# EAGLE design Serial-7-Segment-Display (EAGLE 6.4)
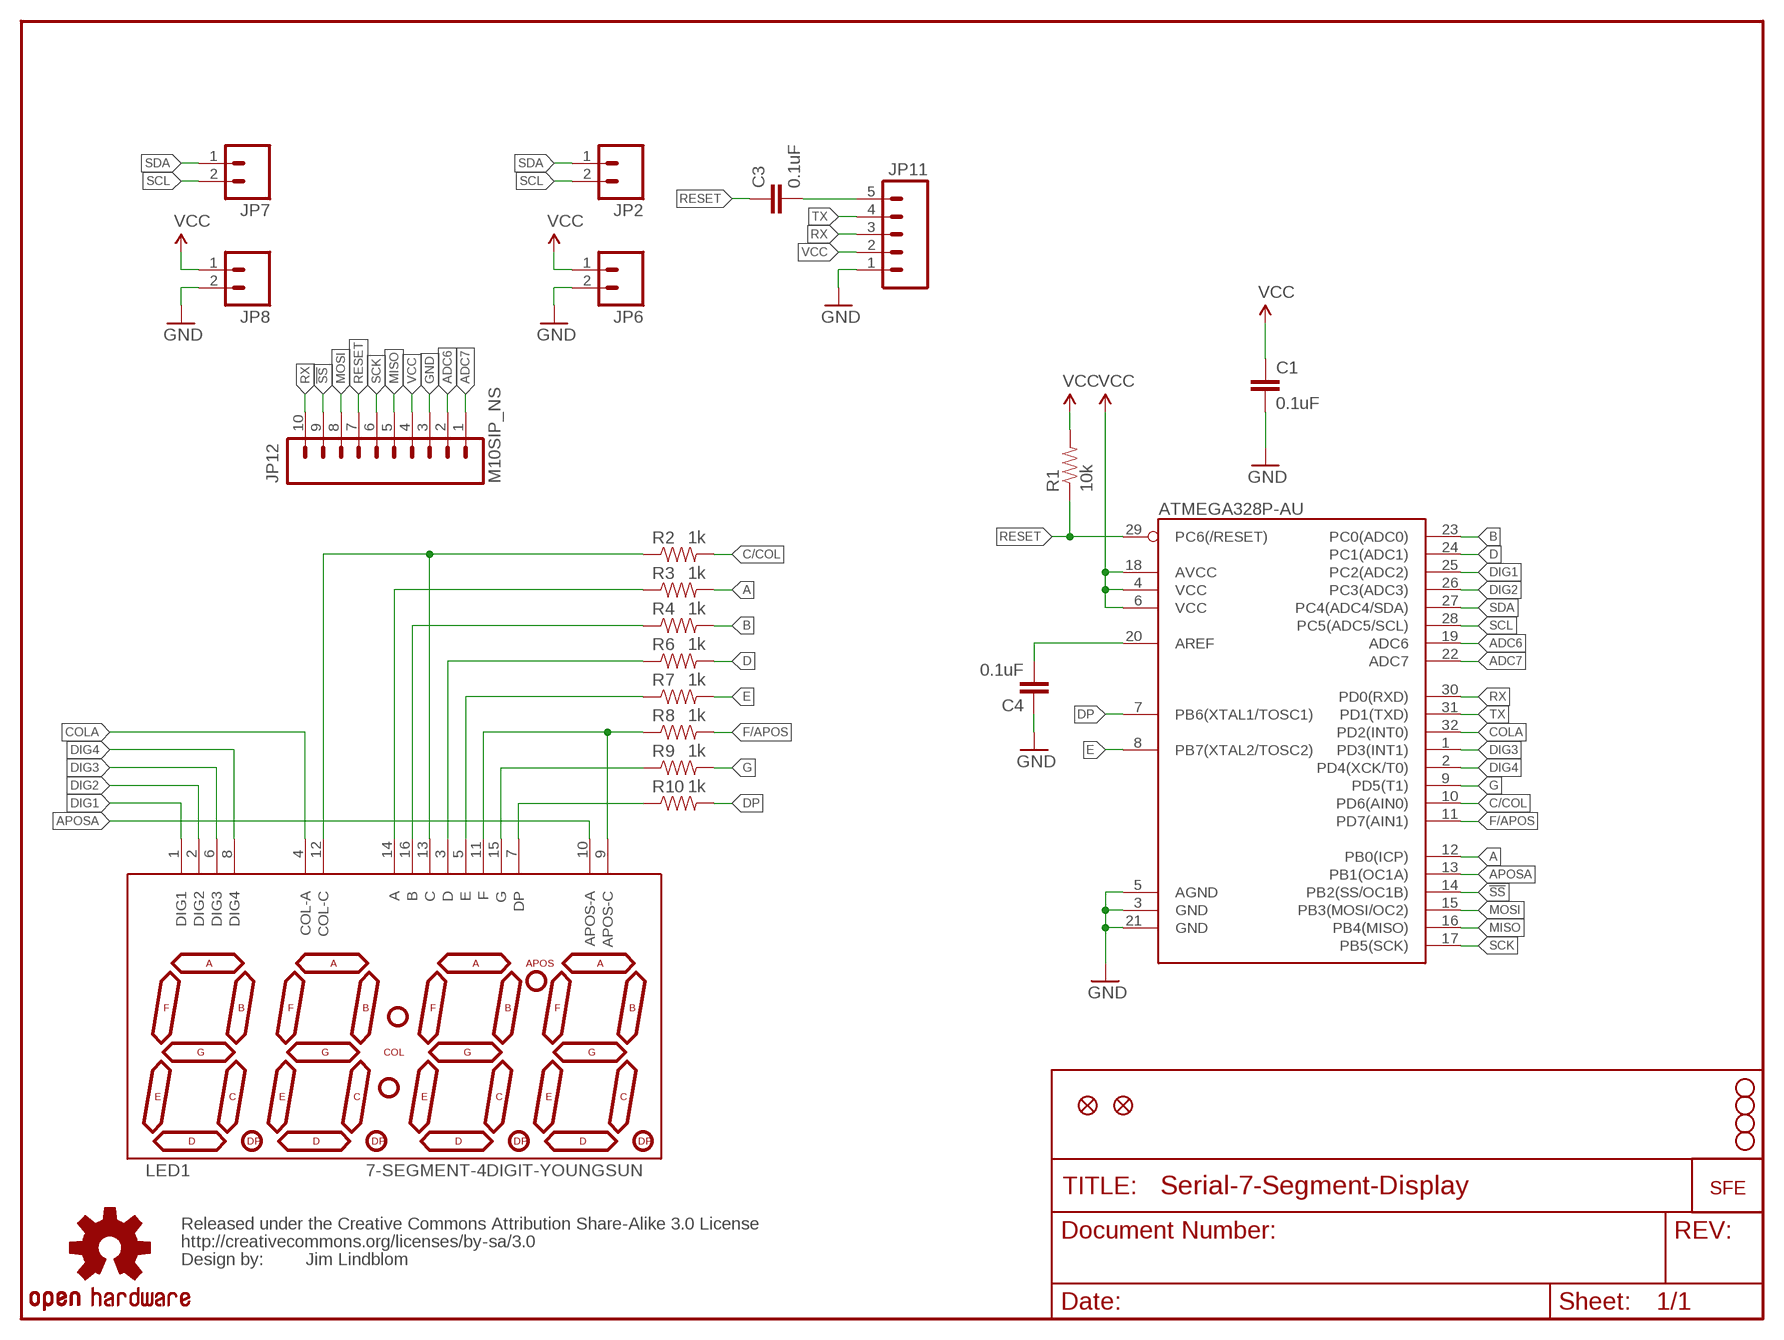
[diagram p0: schematic, sheet 1]

## Parts
ATMEGA328P-AU  ATMEGA328P-AU  ATMEGA168  [TQFP32-08]
C1  0.1uF  CAP0402-CAP  [0402-CAP]
C3  0.1uF  CAP0402-CAP  [0402-CAP]
C4  0.1uF  CAP0402-CAP  [0402-CAP]
JP1  STAND-OFF  [STAND-OFF]
JP2  M021X02_NO_SILK  [1X02_NO_SILK]
JP3  STAND-OFF  [STAND-OFF]
JP4  STAND-OFF  [STAND-OFF]
JP5  STAND-OFF  [STAND-OFF]
JP6  M021X02_NO_SILK  [1X02_NO_SILK]
JP7  M021X02_NO_SILK  [1X02_NO_SILK]
JP8  M021X02_NO_SILK  [1X02_NO_SILK]
JP9  FIDUCIALUFIDUCIAL  [MICRO-FIDUCIAL]
JP10  FIDUCIALUFIDUCIAL  [MICRO-FIDUCIAL]
JP11  M05PTH-NS  [1X05_NO_SILK]
JP12  M10SIP_NS  [1X10_NO_SILK]
LED1  7-SEGMENT-4DIGIT-YOUNGSUN  [7-SEGMENT-4DIGIT-YOUNGSUN]
R1  10k  RESISTOR0402-RES  [0402-RES]
R2  1k  RESISTOR0402-RES  [0402-RES]
R3  1k  RESISTOR0402-RES  [0402-RES]
R4  1k  RESISTOR0402-RES  [0402-RES]
R6  1k  RESISTOR0402-RES  [0402-RES]
R7  1k  RESISTOR0402-RES  [0402-RES]
R8  1k  RESISTOR0402-RES  [0402-RES]
R9  1k  RESISTOR0402-RES  [0402-RES]
R10  1k  RESISTOR0402-RES  [0402-RES]
U$1  CREATIVE_COMMONS  [CREATIVE_COMMONS]
U$2  LOGO-SFESK  [SFE-LOGO-FLAME]
U$4  OSHW-LOGOS  [OSHW-LOGO-S]

## Nets
!SS: ATMEGA328P-AU.14(PB2(SS/OC1B)) JP12.9
A: ATMEGA328P-AU.12(PB0(ICP)) R3.2
ADC6: ATMEGA328P-AU.19(ADC6) JP12.2
ADC7: ATMEGA328P-AU.22(ADC7) JP12.1
APOSA: ATMEGA328P-AU.13(PB1(OC1A)) LED1.10(APOS-A)
B: ATMEGA328P-AU.23(PC0(ADC0)) R4.2
C/COL: ATMEGA328P-AU.10(PD6(AIN0)) R2.2
COLA: ATMEGA328P-AU.32(PD2(INT0)) LED1.4(COL-A)
D: ATMEGA328P-AU.24(PC1(ADC1)) R6.2
DIG1: ATMEGA328P-AU.25(PC2(ADC2)) LED1.1(DIG1)
DIG2: ATMEGA328P-AU.26(PC3(ADC3)) LED1.2(DIG2)
DIG3: ATMEGA328P-AU.1(PD3(INT1)) LED1.6(DIG3)
DIG4: ATMEGA328P-AU.2(PD4(XCK/T0)) LED1.8(DIG4)
DP: ATMEGA328P-AU.7(PB6(XTAL1/TOSC1)) R10.2
E: ATMEGA328P-AU.8(PB7(XTAL2/TOSC2)) R7.2
F/APOS: ATMEGA328P-AU.11(PD7(AIN1)) R8.2
G: ATMEGA328P-AU.9(PD5(T1)) R9.2
GND: ATMEGA328P-AU.3(GND) ATMEGA328P-AU.5(AGND) ATMEGA328P-AU.21(GND) C1.2 C4.1 JP6.2 JP8.2 JP11.1 JP12.3
MISO: ATMEGA328P-AU.16(PB4(MISO)) JP12.5
MOSI: ATMEGA328P-AU.15(PB3(MOSI/OC2)) JP12.8
N$1: ATMEGA328P-AU.20(AREF) C4.2
N$2: LED1.7(DP) R10.1
N$3: LED1.15(G) R9.1
N$4: LED1.9(APOS-C) LED1.11(F) R8.1
N$5: LED1.5(E) R7.1
N$6: LED1.3(D) R6.1
N$8: LED1.16(B) R4.1
N$9: LED1.14(A) R3.1
N$10: LED1.12(COL-C) LED1.13(C) R2.1
N$13: C3.2 JP11.5
RESET: ATMEGA328P-AU.29(PC6(/RESET)) C3.1 JP12.7 R1.1
RX: ATMEGA328P-AU.30(PD0(RXD)) JP11.3 JP12.10
SCK: ATMEGA328P-AU.17(PB5(SCK)) JP12.6
SCL: ATMEGA328P-AU.28(PC5(ADC5/SCL)) JP2.2 JP7.2
SDA: ATMEGA328P-AU.27(PC4(ADC4/SDA)) JP2.1 JP7.1
TX: ATMEGA328P-AU.31(PD1(TXD)) JP11.4
VCC: ATMEGA328P-AU.4(VCC) ATMEGA328P-AU.6(VCC) ATMEGA328P-AU.18(AVCC) C1.1 JP6.1 JP8.1 JP11.2 JP12.4 R1.2

## Notes on the sheet
- Jim Lindblom

## Library data of the parts
ATMEGA328P-AU = SparkFun:ATMEGA168
C1 = SparkFun:CAP: Capacitor Standard 0603 ceramic capacitor, and 0.1" leaded capacitor.
C3 C4 = SparkFun-Passives:CAP: Capacitor Standard 0603 ceramic capacitor, and 0.1" leaded capacitor.
JP1 JP3-JP5 = SparkFun-Electromechanical:STAND-OFF: #4 Stand Off This is the mechanical footprint for a #4 phillips button head screw. Use the keepout ring to avoid running the screw head into surrounding components. SKU : PRT-00447
JP2 JP6-JP8 = SparkFun-Connectors:M02: Header 2 Standard 2-pin 0.1" header. Use with straight break away headers (SKU : PRT-00116), right angle break away headers (PRT-00553), swiss pins (PRT-00743), machine pins (PRT-00117), and female headers (PRT-00115). Molex polarized connector foot print use with SKU : PRT-08233 with associated crimp pins and housings.
JP9 JP10 = SparkFun:FIDUCIAL: Fiducial Alignment Points Various fiducial points for machine vision alignment.
JP11 = SparkFun-Connectors:M05: Header 5 Standard 5-pin 0.1" header. Use with straight break away headers (SKU : PRT-00116), right angle break away headers (PRT-00553), swiss pins (PRT-00743), machine pins (PRT-00117), and female headers (PRT-00115). Molex polarized connector foot print use with SKU : PRT-08230 with associated crimp pins and housings.
JP12 = SparkFun-Connectors:M10: Header 10 Standard 10-pin 0.1" header. Use with straight break away headers (SKU : PRT-00116), right angle break away headers (PRT-00553), swiss pins (PRT-00743), machine pins (PRT-00117), and female headers (PRT-00115).
LED1 = SparkFun:7-SEGMENT-4DIGIT-YOUNGSUN: This is a part for the 4-Digit 7-segment LEDs from Young Sun. Different from the Digikey LEDs, all 16 pins are used. The LONGPADS Variant is used for a test jig, but you may like it because there is more pad to solder to. If you are concerned about routing space, the standard works just fine though.
R1-R4 R6-R10 = SparkFun:RESISTOR: Resistor Basic schematic elements and footprints for 0603, 1206, and PTH 1/10th watt (small) resistors.
U$1 = SparkFun:CREATIVE_COMMONS
U$2 = SparkFun:LOGO-SFE: Spark Fun Electronics PCB Logo This is the standard Spark Fun Electronics PCB logo.
U$4 = SparkFun-Aesthetics:OSHW-LOGO: Open Source Hardware Logo This logo indicates the piece of hardware it is found on incorporates a OSHW license and/or adheres to the definition of open source hardware found here: http://freedomdefined.org/OSHW

## Board
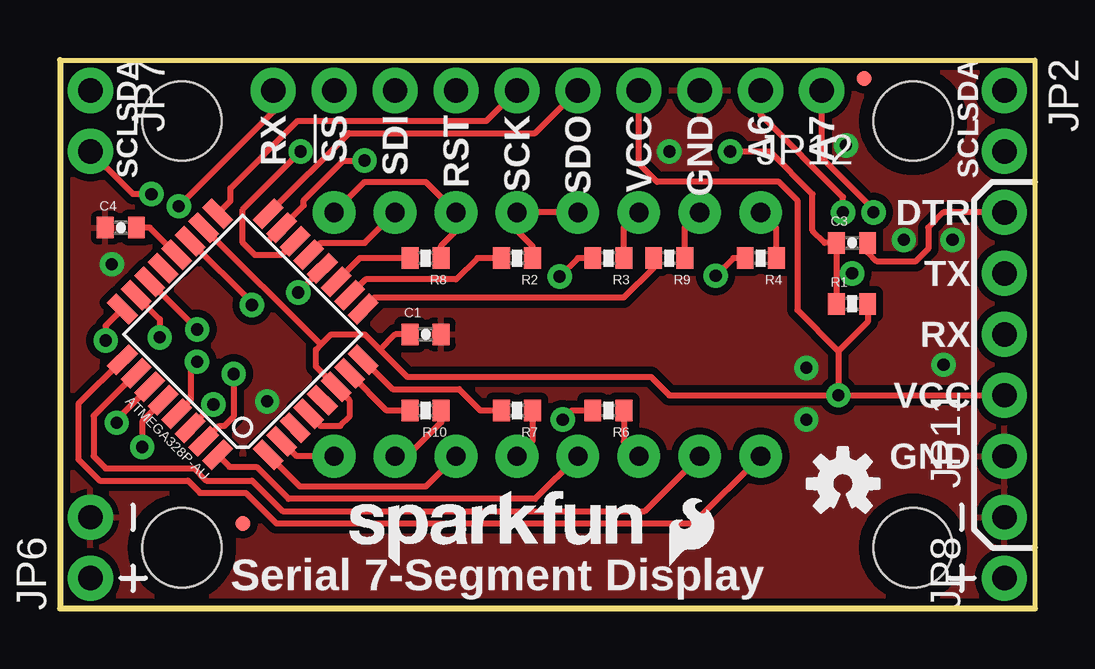
[diagram p1: board, top side]
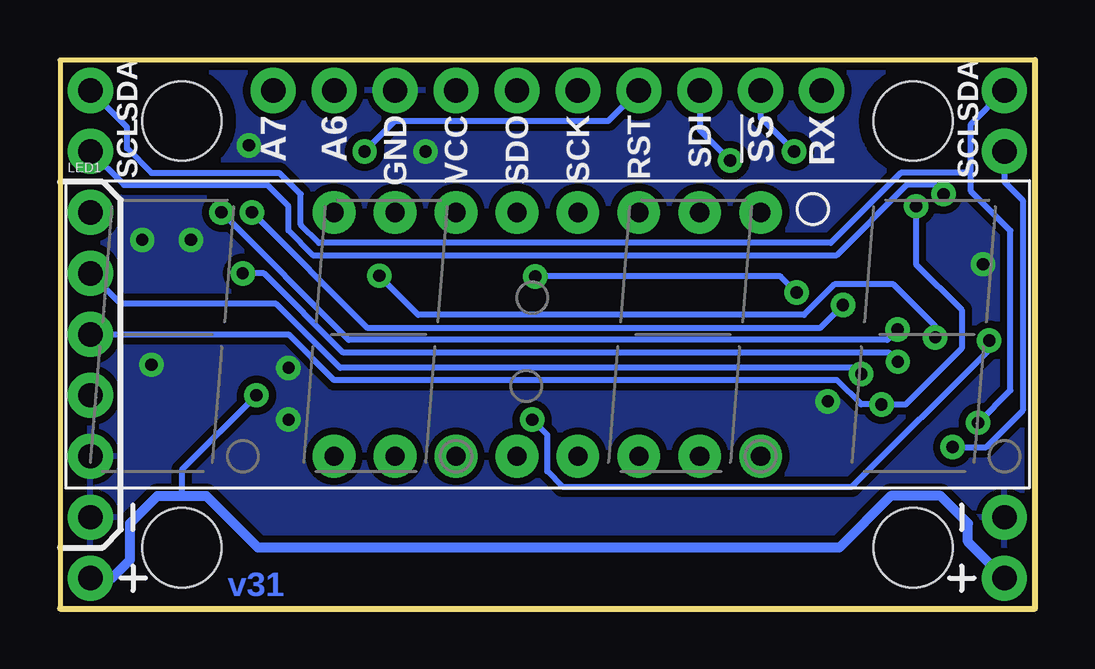
[diagram p2: board, bottom side, seen from below]

Size 40.64 x 22.86 mm. Coordinates in mm from the lower left corner, seen from the top.
Outline: 0,22.86 40.64,22.86 40.64,0 0,0 0,22.86
Copper layers (1*16): Top 0.035mm / dielectric 1.5mm / Bottom 0.035mm
Design rules "default": minimum track width 8mil, minimum drill 20mil, track to track 8mil, track to pad 8mil, pad to pad 8mil, via to via 8mil, smd to smd 8mil, copper to edge 8mil, drill to drill 8mil, minimum pad ring 12mil, minimum via ring 10mil, stop-mask expansion 4mil, vias tented up to drill 20mil, thermal gap 10mil

### Footprints (pad centres in the part's own frame; a part is rotated, then mirrored left to right if it is on the bottom)
TQFP32-08 = smd 1.27 x 0.559: 1 -4.293,2.8; 2 -4.293,2; 3 -4.293,1.2; 4 -4.293,0.4; 5 -4.293,-0.4; 6 -4.293,-1.2; 7 -4.293,-2; 8 -4.293,-2.8; 17 4.293,-2.8; 18 4.293,-2; 19 4.293,-1.2; 20 4.293,-0.4; 21 4.293,0.4; 22 4.293,1.2; 23 4.293,2; 24 4.293,2.8 | smd 0.559 x 1.27: 9 -2.8,-4.293; 10 -2,-4.293; 11 -1.2,-4.293; 12 -0.4,-4.293; 13 0.4,-4.293; 14 1.2,-4.293; 15 2,-4.293; 16 2.8,-4.293; 25 2.8,4.293; 26 2,4.293; 27 1.2,4.293; 28 0.4,4.293; 29 -0.4,4.293; 30 -1.2,4.293; 31 -2,4.293; 32 -2.8,4.293
0402-CAP = smd 0.7 x 0.9: 1 -0.65,0; 2 0.65,0
STAND-OFF = hole 3.302: 0,0
1X02_NO_SILK = drill 1.016 pad 1.88: 1 0,0; 2 2.54,0
MICRO-FIDUCIAL = smd 0.635 x 0.635: 1 0,0
1X05_NO_SILK = drill 1.016 pad 1.88: 1 0,0; 2 2.54,0; 3 5.08,0; 4 7.62,0; 5 10.16,0
1X10_NO_SILK = drill 1.016 pad 1.88: 1 0,0; 2 2.54,0; 3 5.08,0; 4 7.62,0; 5 10.16,0; 6 12.7,0; 7 15.24,0; 8 17.78,0; 9 20.32,0; 10 22.86,0
7-SEGMENT-4DIGIT-YOUNGSUN = drill 0.8 pad 1.778: 1 -8.89,-5.08; 2 -6.35,-5.08; 3 -3.81,-5.08; 4 -1.27,-5.08; 5 1.27,-5.08; 6 3.81,-5.08; 7 6.35,-5.08; 8 8.89,-5.08; 9 8.89,5.08; 10 6.35,5.08; 11 3.81,5.08; 12 1.27,5.08; 13 -1.27,5.08; 14 -3.81,5.08; 15 -6.35,5.08; 16 -8.89,5.08
0402-RES = smd 0.7 x 0.9: 1 -0.65,0; 2 0.65,0

### Placement (x,y rotation side)
ATMEGA328P-AU  7.62,11.43 135 top
C1  15.24,11.43 0 top
C3  33.02,15.24 0 top
C4  2.54,15.88 0 top
JP1  5.08,2.54 0 top
JP2  39.37,21.59 270 top
JP3  5.08,20.32 0 top
JP4  35.56,2.54 0 top
JP5  35.56,20.32 0 top
JP6  1.27,1.27 90 top
JP7  1.27,21.59 270 top
JP8  39.37,1.27 90 top
JP9  33.53,22.1 0 top
JP10  7.62,3.56 0 top
JP11  39.37,6.35 90 top
JP12  31.75,21.59 180 top
LED1  20.32,11.43 0 bottom
R1  33.02,12.7 0 top
R2  19.05,14.61 180 top
R3  22.86,14.61 180 top
R4  29.21,14.61 180 top
R6  22.86,8.26 180 top
R7  19.05,8.26 180 top
R8  15.24,14.61 180 top
R9  25.4,14.61 180 top
R10  15.24,8.26 180 top
U$1  1.27,-10.16 0 top  (outside the outline)
U$2  25.4,1.78 0 top
U$3  LOGO-SFENW2  [SFE-NEW-WEB]  12.06,1.78 0 top
U$4  32.64,5.21 0 top

### Tracks (layer width: path | path; a pad name or v marks a point on that pad's centre or on a via)
!SS  (via drill 0.51)
  Top 0.254: ATMEGA328P-AU.14 9.22,14.73 8.13,14.73 7.62,15.24 7.62,16.64 v10.03,19.05
  Bottom 0.254: v10.03,19.05 11.43,20.45 JP12.9
A  (via drill 0.51)
  Top 0.254: R3.2 21.59,14.61 v20.83,13.84 | ATMEGA328P-AU.12 v9.93,13.18
  Bottom 0.254: v9.93,13.18 10.6,13.84 v20.83,13.84
ADC6  (via drill 0.51)
  Top 0.254: ATMEGA328P-AU.19 8,12.75 v8,12.65 | v32.64,16.51 32.64,17.14 29.21,20.57 JP12.2
  Bottom 0.254: v32.64,16.51 27.81,11.68 8.97,11.68 v8,12.65
ADC7  (via drill 0.51)
  Top 0.254: JP12.1 31.75,18.8 33.91,16.64 v33.91,16.51 | ATMEGA328P-AU.22 v5.72,11.63
  Bottom 0.254: v33.91,16.51 28.6,11.2 6.15,11.2 v5.72,11.63
APOSA
  Top 0.254: LED1.10 12.7,15.24 10.86,15.24 ATMEGA328P-AU.13
B  (via drill 0.51)
  Top 0.254: ATMEGA328P-AU.23 4.16,12.06 v4.16,11.3 | R4.2 28.07,14.61 v27.33,13.87
  Bottom 0.254: v4.16,11.3 4.16,11.78 5.89,13.51 8.36,13.51 9.63,12.24 25.7,12.24 v27.33,13.87
C/COL
  Top 0.254: R2.2 17.4,14.61 16.51,13.72 12.73,13.72 ATMEGA328P-AU.10
COLA
  Top 0.254: LED1.4 19.81,4.57 9.53,4.57 8.19,5.91 7.07,5.91 ATMEGA328P-AU.32
D  (via drill 0.51)
  Top 0.254: ATMEGA328P-AU.24 1.91,11.79 v1.91,11.18 | R6.2 21.34,8.26 v20.95,7.87
  Bottom 0.254: v20.95,7.87 20.32,7.24 20.32,5.71 19.68,5.08 7.62,5.08 1.91,10.79 v1.91,11.18
DIG1
  Top 0.254: ATMEGA328P-AU.25 0.76,8.53 0.76,6.22 1.65,5.33 5.33,5.33 5.84,4.83 7.75,4.83 9.02,3.56 26.42,3.56 LED1.1
DIG2
  Top 0.254: ATMEGA328P-AU.26 1.4,8.04 1.4,6.35 1.91,5.84 5.59,5.84 6.1,5.33 8,5.33 9.27,4.06 24.38,4.06 LED1.2
DIG3
  Top 0.254: LED1.6 15.24,5.08 10.01,5.08 ATMEGA328P-AU.1
DIG4
  Top 0.254: LED1.8 9.87,6.35 ATMEGA328P-AU.2
DP
  Top 0.254: ATMEGA328P-AU.7 13.62,8.26 R10.2
E
  Top 0.254: ATMEGA328P-AU.8 13.87,9.14 16.64,9.14 17.53,8.26 R7.2
F/APOS
  Top 0.254: R8.2 12.49,14.61 ATMEGA328P-AU.11
G
  Top 0.254: R9.2 24.75,14.21 23.5,12.95 13.1,12.95 ATMEGA328P-AU.9
GND  (via drill 0.51)
  other vias: 31.11,7.87 2.16,14.35 37.21,15.37 36.83,10.16 31.11,10.03 8.64,8.64 25.4,19.05 32.77,19.3 35.18,15.37
  pour Top (isolate 0.305): 0,0 0,22.86 40.64,22.86 40.64,0
  pour Bottom (isolate 0.305): 0,0 0,22.86 40.64,22.86 40.64,0
MISO
  Top 0.254: ATMEGA328P-AU.16 12.04,19.81 19.81,19.81 JP12.5
MOSI  (via drill 0.51)
  Top 0.254: 8.73,15.37 ATMEGA328P-AU.15 10.16,16.8 10.16,17.02 11.81,18.67 v12.7,18.67
  Bottom 0.254: JP12.8 13.97,19.94 v12.7,18.67
N$1
  Top 0.254: ATMEGA328P-AU.20 3.74,15.88 C4.2
N$2
  Top 0.254: LED1.7 14.48,6.35 15.89,7.76 R10.1
N$3
  Top 0.254: R9.1 26.05,15.89 LED1.15
N$4
  Top 0.254: R8.1 15.89,15.13 16.51,15.75 LED1.11 15.24,17.78 12.7,17.78 LED1.9
N$5
  Top 0.254: R7.1 19.7,7 LED1.5
N$6
  Top 0.254: R6.1 23.51,6.97 LED1.3
N$8
  Top 0.254: R4.1 29.86,15.86 LED1.16
N$9
  Top 0.254: R3.1 23.51,15.89 LED1.14
N$10
  Top 0.254: R2.1 19.7,15.1 19.05,15.75 LED1.12 LED1.13
N$13
  Top 0.254: JP11.5 36.83,16.51 36.2,15.88 36.2,14.99 35.69,14.48 34.04,14.48 33.67,14.84 C3.2
RESET  (via drill 0.51)
  Top 0.254: ATMEGA328P-AU.29 5.46,8.71 5.46,10.03 v5.71,10.29 | 32.37,13.97 C3.1 31.88,15.24 31.37,15.75 31.37,17.27 29.59,19.05 v27.94,19.05 | 32.37,13.97 R1.1 | v33.02,13.97 32.37,13.97
  Bottom 0.254: v27.94,19.05 26.67,20.32 17.78,20.32 JP12.7 | v33.02,13.97 32.13,13.97 28.83,10.67 6.1,10.67 v5.71,10.29
RX  (via drill 0.51)
  Top 0.254: ATMEGA328P-AU.30 v6.4,8.51 | JP12.10 8.89,20.7 v4.95,16.76
  Bottom 0.254: JP11.3 31.11,11.43 29.21,9.53 8.26,9.53 7.24,8.51 v6.4,8.51 | v4.95,16.76 4.95,14.35 3.05,12.45 3.05,10.84 5.38,8.51 v6.4,8.51 | v6.4,8.51 6.73,8.51
SCK
  Top 0.254: ATMEGA328P-AU.17 7.11,16.99 7.11,17.53 9.91,20.32 17.78,20.32 JP12.6
SCL  (via drill 0.51)
  Top 0.254: ATMEGA328P-AU.28 3.43,7.8 v3.43,6.73 | v3.81,17.27 3.05,17.27 JP7.2
  Bottom 0.254: JP7.2 1.27,17.78 0.51,17.02 0.51,8.26 2.03,6.73 v3.43,6.73 | JP2.2 37.97,17.65 32,17.65 31.11,16.76 31.11,15.75 30.1,14.73 8.26,14.73 5.33,17.65 4.19,17.65 v3.81,17.27
SDA  (via drill 0.51)
  Top 0.254: ATMEGA328P-AU.27 2.37,7.87 v2.37,7.75
  Bottom 0.254: v2.37,7.75 1.02,9.1 1.02,15.75 2.67,17.4 2.67,18.16 | 2.67,18.16 2.67,20.19 JP7.1 | JP2.1 37.85,20.07 37.85,19.18 36.83,18.16 31.5,18.16 30.61,17.27 30.61,16 29.84,15.24 8.51,15.24 5.59,18.16 2.67,18.16
TX  (via drill 0.51)
  Top 0.254: ATMEGA328P-AU.31 6.64,7.62 6.86,7.62 7.24,8 v7.24,9.78
  Bottom 0.254: v7.24,9.78 7.49,10.03 28.96,10.03 31.62,12.7 38.1,12.7 JP11.4
VCC  (via drill 0.51)
  Top 0.254: ATMEGA328P-AU.18 10.86,11.02 10.86,10.99 | 32.45,10.73 30.73,12.45 30.73,17.02 29.97,17.78 24.89,17.78 24.13,18.54 JP12.4 | R1.2 33.67,11.95 32.45,10.73 | 13.34,10.79 12.7,11.43 11.3,11.43 10.86,10.99 | 13.34,10.79 14.48,9.65 24.64,9.65 25.4,8.89 v32.45,8.89 | C1.1 13.97,11.43 13.34,10.79 | ATMEGA328P-AU.4 10.86,7.62 11.68,7.62 12.06,8 12.06,8.68 ATMEGA328P-AU.6 10.67,10.08 10.67,10.79 10.86,10.99 | 32.45,10.73 v32.45,8.89 | v32.45,8.89 JP11.2
  Bottom 0.254: v32.45,8.89 35.56,5.78 35.56,4.7
  Bottom 0.406: JP6.1 2.79,2.79 2.79,3.56 3.94,4.7 5.99,4.7 8.15,2.54 32.38,2.54 34.54,4.7 35.56,4.7 36.58,4.7 37.72,3.56 37.72,2.03 38.48,1.27 JP8.1

### Text on the board
Bottom: v31
tPlace: SDA | SDA | RX | !SS | SDI | RST | SCK | SDO | VCC | GND | A6 | A7 | SCL | SCL | DTR | TX | RX | VCC | GND | Serial 7-Segment Display
bPlace: SDA | SDA | RX | !SS | SDI | RST | SCK | SDO | VCC | GND | A6 | A7 | SCL | SCL